# EAGLE design wemos_13a_moist (EAGLE 9.5.1)
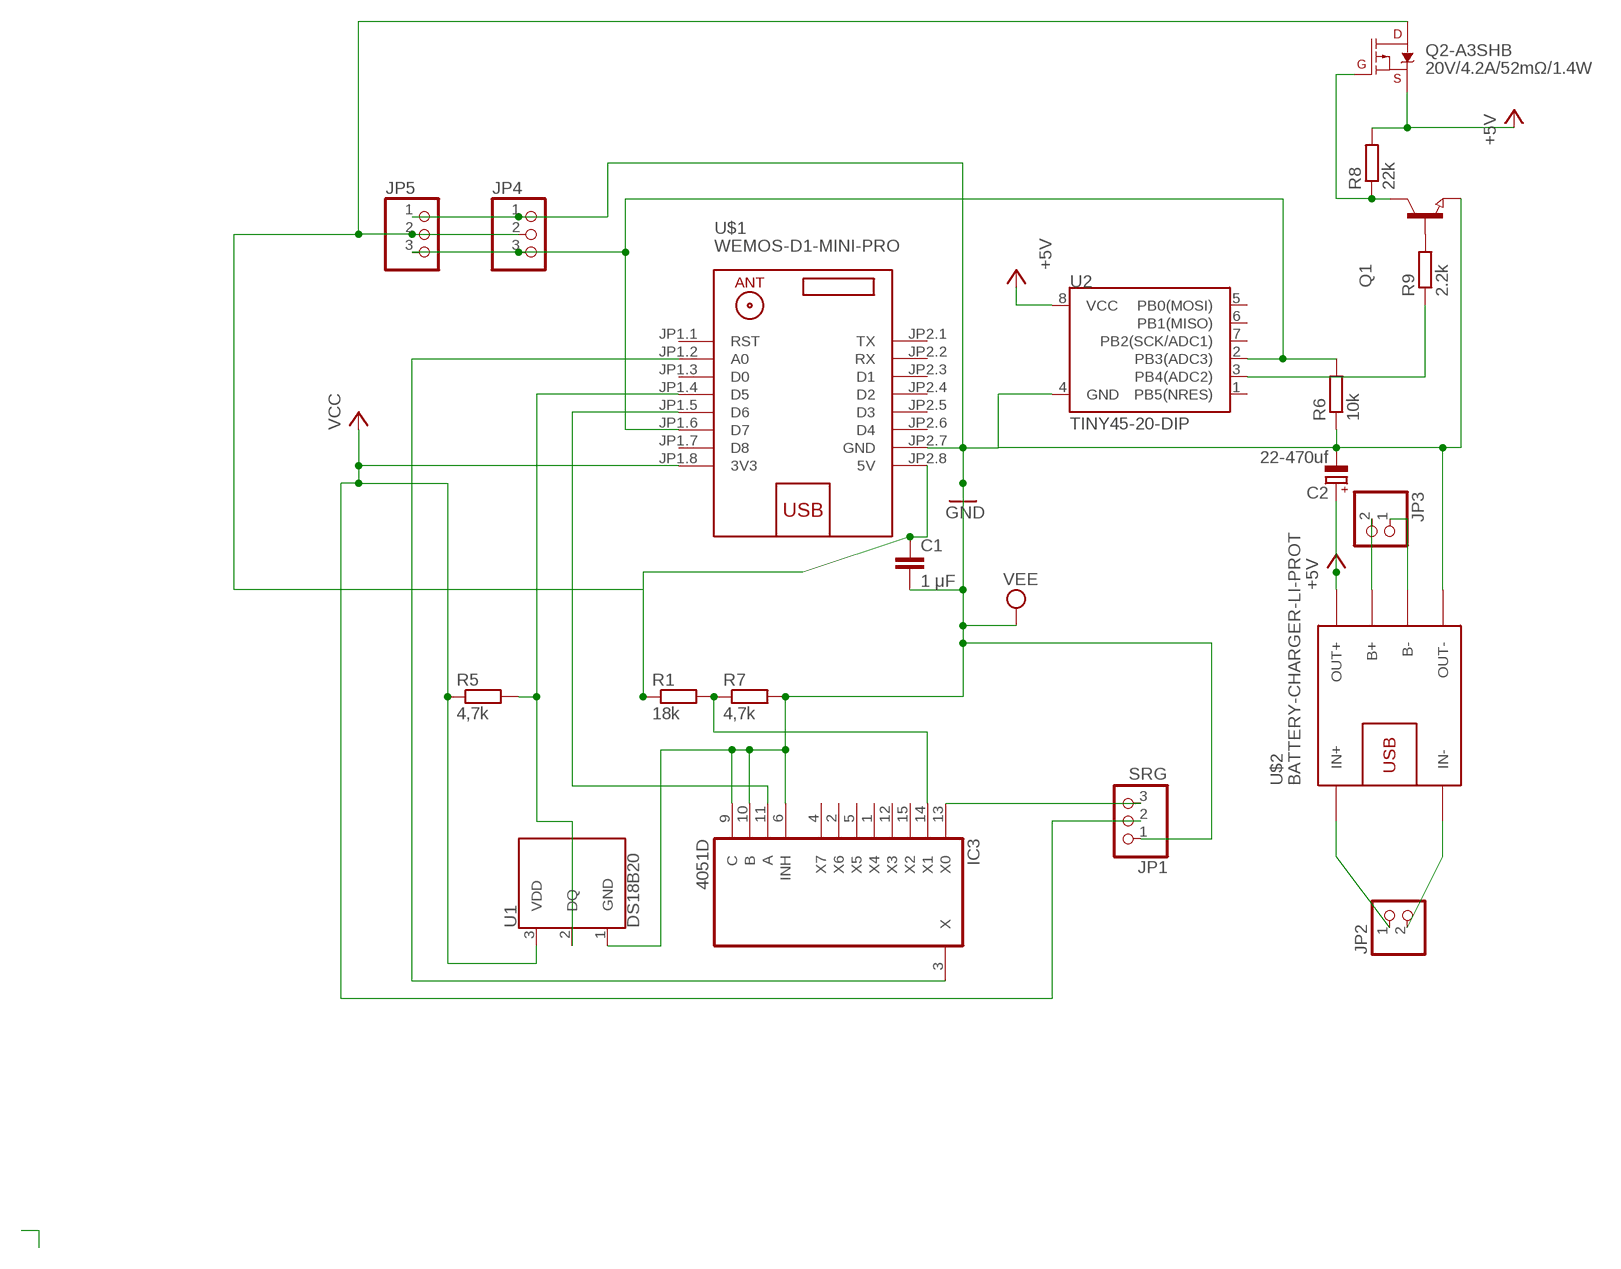
[diagram p0: schematic, sheet 1]

## Parts
C1  1 μF  C-EU025-024X044  [C025-024X044]
C2  22-470uf  CPOL-EUE2.5-5  [E2,5-5]
IC3  4051D  [SO16]
JP1  SRG  PINHD-1X3/90  [1X03/90]
JP2  PINHD-1X2  [1X02]
JP3  PINHD-1X2  [1X02]
JP4  PINHD-1X3  [1X03]
JP5  PINHD-1X3  [1X03]
Q1  NPN-TRANSISTOR_SOT23  [SOT23]
Q2-A3SHB  20V/4.2A/52mΩ/1.4W  MOSFET_PCH-DMG2305UX-7  [SOT23-3]
R1  18k  R-EU_0204/7  [0204/7]
R5  4,7k  R-EU_M1206  [M1206]
R6  10k  R-EU_M1206  [M1206]
R7  4,7k  R-EU_M1206  [M1206]
R8  22k  R-EU_M1206  [M1206]
R9  2.2k  R-EU_M1206  [M1206]
U1  DS18B20  [TO-92-AMMO]
U2  TINY45-20-DIP  ATTINY45TINY45-20-DIP  [DIP08_MCU]
U$1  WEMOS-D1-MINI-PRO  [WEMOS-D1-MINI-PRO]
U$2  BATTERY-CHARGER-LI-PROT  [BATTERY-CHARGER-LI-PROT]

## Nets
+5V: C2.+ Q1.3(C) Q2-A3SHB.1(G) Q2-A3SHB.2(S) R8.1 R8.2 U2.8(VCC) U$2.OUT+
GND: C1.2 C2.- IC3.6(INH) IC3.9(C) IC3.10(B) JP1.1 JP4.1 JP5.1 Q1.2(E) R6.1 R7.2 U1.1(GND) U2.4(GND) U$1.JP2.7(GND) U$2.OUT- ; supply symbol labelled VEE
N$1: JP3.2 U$2.B+
N$2: IC3.14(X1) R1.2 R7.1
N$3: IC3.11(A) U$1.JP1.5(D6)
N$4: IC3.3(X) U$1.JP1.2(A0)
N$5: JP3.1 U$2.B-
N$6: JP2.1 U$2.IN+
N$7: IC3.13(X0) JP1.3
N$8: R9.1 U2.3(PB4(ADC2))
N$9: JP4.3 JP5.3 R6.2 U2.2(PB3(ADC3)) U$1.JP1.6(D7)
N$12: Q1.1(B) R9.2
N$13: JP2.2 U$2.IN-
N$18: C1.1 JP4.2 JP5.2 Q2-A3SHB.3(D) R1.1 U$1.JP2.8(5V)
TEMP: R5.2 U1.2(DQ) U$1.JP1.4(D5)
VCC: JP1.2 R5.1 U1.3(VDD) U$1.JP1.8(3V3)
Unconnected: IC3.1(X4) IC3.2(X6) IC3.4(X7) IC3.5(X5) IC3.12(X3) IC3.15(X2) U2.1(PB5(NRES)) U2.5(PB0(MOSI)) U2.6(PB1(MISO)) U2.7(PB2(SCK/ADC1)) U$1.JP1.1(RST) U$1.JP1.3(D0) U$1.JP1.7(D8) U$1.JP2.1(TX) U$1.JP2.2(RX) U$1.JP2.3(D1) U$1.JP2.4(D2) U$1.JP2.5(D3) U$1.JP2.6(D4)

## Power pins joined to a net without a drawn wire
GND: IC3.7(VEE) IC3.8(GND)
VCC: IC3.16(VCC)

## Library data of the parts
C1 = rcl:C-EU: CAPACITOR, European symbol; SPICEPREFIX: C
C2 = rcl:CPOL-EU: POLARIZED CAPACITOR, European symbol; SPICEPREFIX: C
IC3 = 40xx:4051: 8-channel ANALOG MULTIPLEXER
JP1 JP4 JP5 = pinhead:PINHD-1X3: PIN HEADER
JP2 JP3 = pinhead:PINHD-1X2: PIN HEADER
Q1 = semicon-smd-ipc:NPN-TRANSISTOR_: NPN TRANSISTOR
Q2-A3SHB = SparkFun-DiscreteSemi:MOSFET_PCH: P-channel MOSFETs Voltage controlled devices that allow control of high current outputs. SparkFun Products: SparkFun ESP32 Thing <https://www.sparkfun.com/products/13907> SparkFun ESP8266 Thing <https://www.sparkfun.com/products/13231> SparkFun Pi Servo HAT V2 <https://www.sparkfun.com/products/15316> DMG2305UX-7 (20V/4.2A/SOT23-3); PROD_ID: TRAN-14388
R1 R5-R9 = rcl:R-EU_: RESISTOR, European symbol; SPICEPREFIX: R
U1 = SparkFun-Sensors:DS18B20: Dallas/Maxim DS18B20 1-Wire Temperature Sensor The DS18B20 reports degrees C with 9 to 12-bit precision, -55C to 125C (+/-0.5C). Each sensor has a unique 64-Bit Serial number etched into it - allows for a huge number of sensors to be used on one data bus. Datasheet <http://datasheets.maximintegrated.com/en/ds/DS18B20.pdf> SparkFun Products One Wire Digital Temperature Sensor - DS18B20 <https://www.sparkfun.com/products/245> (SEN-00245); STORE_ID: SEN-00245
U2 = SparkFun-Retired:ATTINY45: Atmel 8-pin 2/4/8kB flash uC Retired; PROD_ID: IC-09439
U$1 = diy-modules:WEMOS-D1-MINI-PRO: WEMOS D1 mini Pro: Mini Wi-Fi Board based on ESP-8266EX chip More details can be found here: https://www.wemos.cc/product/d1-mini-pro.html Click here to find device on ebay.com <http://www.ebay.com/sch/wemos+d1+mini+pro>
U$2 = diy-modules:BATTERY-CHARGER-LI-PROT: Lithium Battery 5V Charger with protection circuit More details available here: http://www.instructables.com/id/DIY-Lithium-ion-Battery-Charger/step4/TP4056-based-lithium-ion-battery-charger-module/ Click here to find device on ebay.com <http://www.ebay.com/sch/tp4056+charger+usb+protection>

## Board
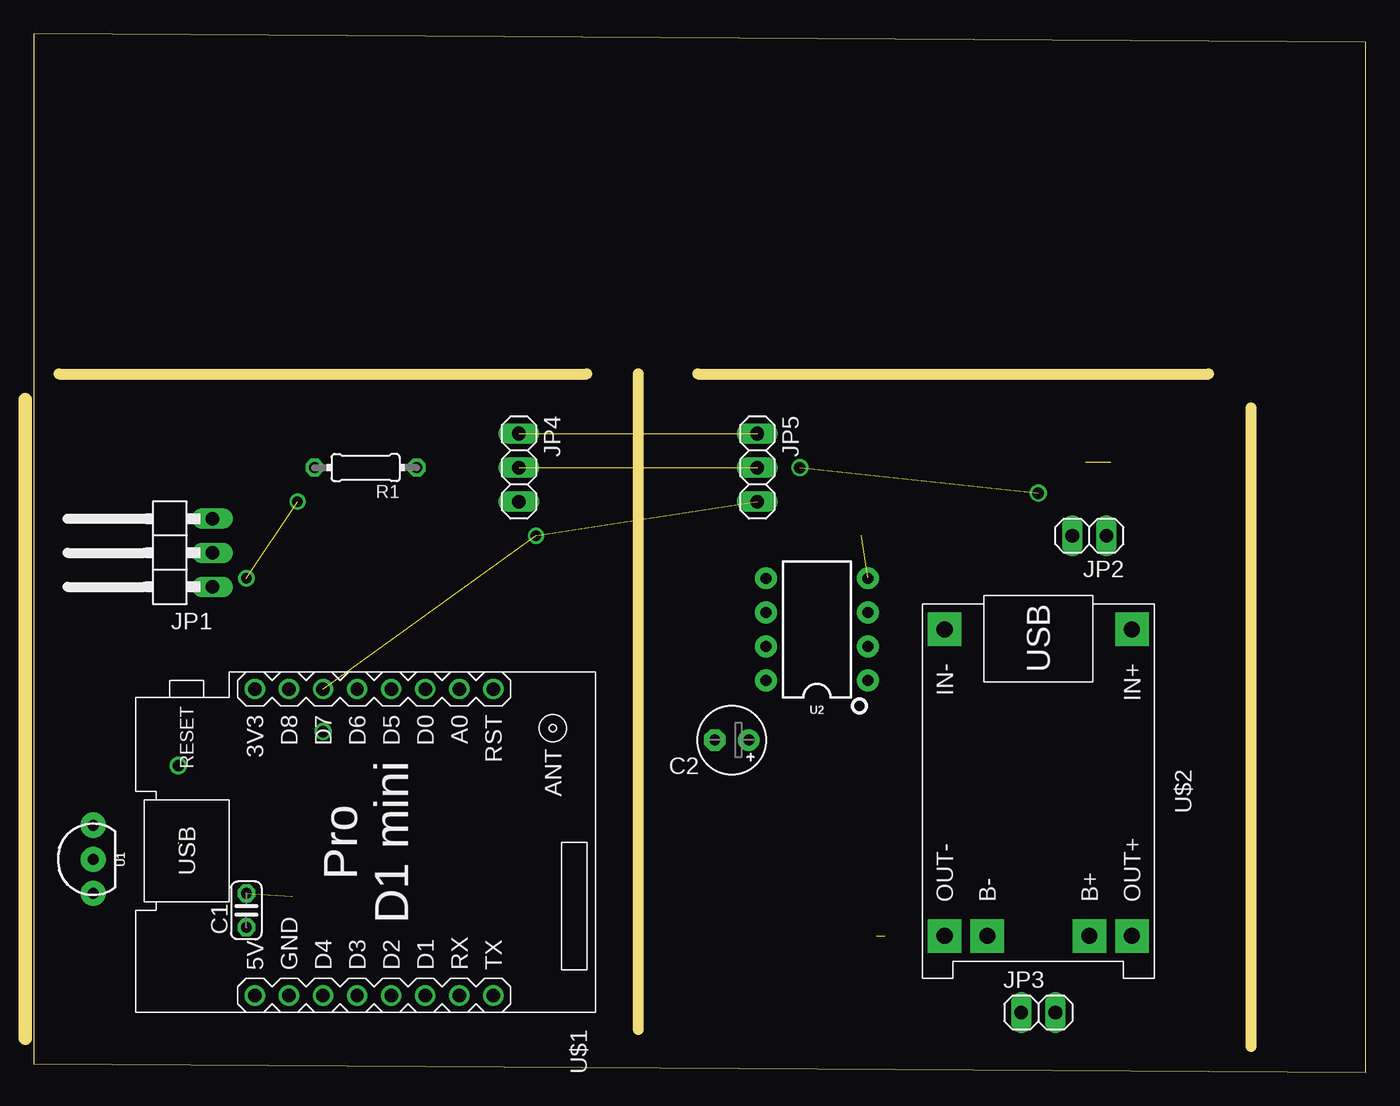
[diagram p1: board, top side]
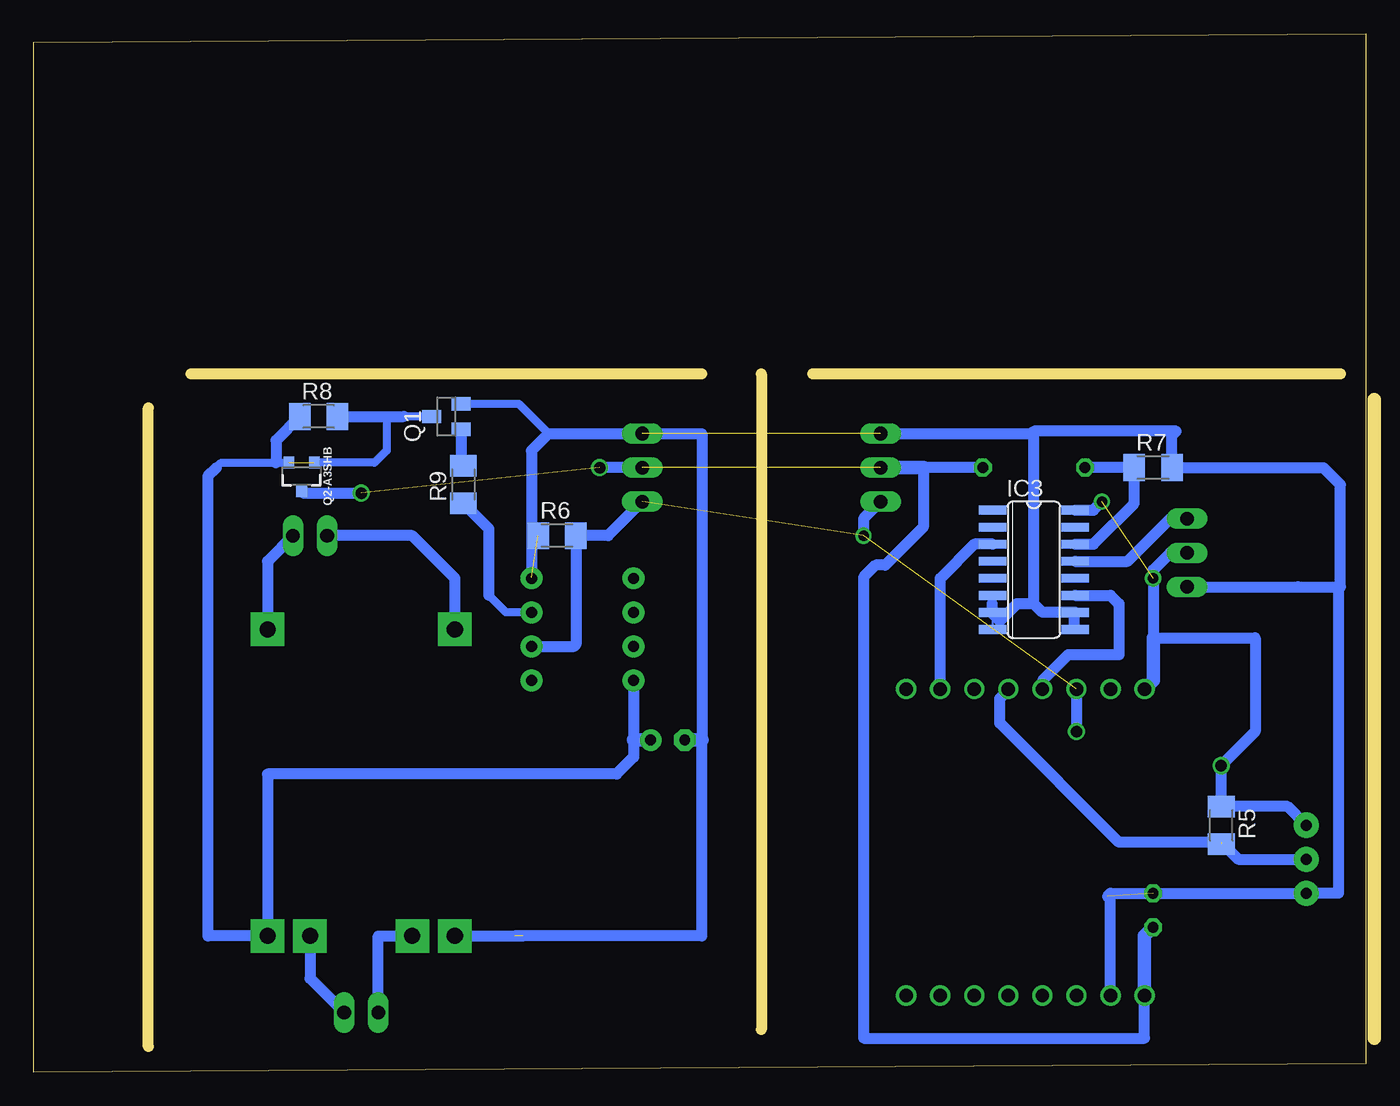
[diagram p2: board, bottom side, seen from below]

Size 99.36 x 77.46 mm. Coordinates in mm from the lower left corner, seen from the top.
Outline: 0,0.64 99.36,0 99.36,76.83 0,77.46 0,0.64
Copper layers (1*16): Top 0.035mm / dielectric 1.5mm / Bottom 0.035mm
Design rules "default": minimum track width 6mil, minimum drill 0.35mm, track to track 6mil, track to pad 6mil, pad to pad 6mil, via to via 6mil, smd to smd 6mil, copper to edge 40mil, drill to drill 6mil, minimum pad ring 10mil, minimum via ring 8mil, stop-mask expansion 4mil, vias tented up to drill 0mil, thermal gap 10mil
Milling: 5 lines

### Footprints (pad centres in the part's own frame; a part is rotated, then mirrored left to right if it is on the bottom)
C025-024X044 = drill 0.813 octagon: 1 -1.27,0; 2 1.27,0
E2,5-5 = drill 0.813 pad 1.6: + -1.27,0 | drill 0.813 pad 1.6 octagon: - 1.27,0
SO16 = smd 0.66 x 2.032: 1 -4.445,-3.073; 2 -3.175,-3.073; 3 -1.905,-3.073; 4 -0.635,-3.073; 5 0.635,-3.073; 6 1.905,-3.073; 7 3.175,-3.073; 8 4.445,-3.073; 9 4.445,3.073; 10 3.175,3.073; 11 1.905,3.073; 12 0.635,3.073; 13 -0.635,3.073; 14 -1.905,3.073; 15 -3.175,3.073; 16 -4.445,3.073
1X03/90 = drill 1.016 long: 1 -2.54,-3.81; 2 0,-3.81; 3 2.54,-3.81
1X02 = drill 1.016 long: 1 -1.27,0; 2 1.27,0
1X03 = drill 1.016 long: 1 -2.54,0; 2 0,0; 3 2.54,0
SOT23 = smd 1 x 1.4: 1 -0.95,-1.1; 2 0.95,-1.1; 3 0,1.1
SOT23-3 = smd 0.8 x 0.9: 1 -0.95,-1; 2 0.95,-1; 3 0,1.1
0204/7 = drill 0.813 octagon: 1 -3.81,0; 2 3.81,0
M1206 = smd 1.6 x 2: 1 -1.4,0; 2 1.4,0
TO-92-AMMO = drill 0.813 pad 1.88: 1 -2.54,0; 2 0,0; 3 2.54,0
DIP08_MCU = drill 0.813 pad 1.626: 1 -3.81,-3.81; 2 -1.27,-3.81; 3 1.27,-3.81; 4 3.81,-3.81; 5 3.81,3.81; 6 1.27,3.81; 7 -1.27,3.81; 8 -3.81,3.81
WEMOS-D1-MINI-PRO = drill 1: JP1.1 -11.43,9.525; JP1.2 -11.43,6.985; JP1.3 -11.43,4.445; JP1.4 -11.43,1.905; JP1.5 -11.43,-0.635; JP1.6 -11.43,-3.175; JP1.7 -11.43,-5.715; JP1.8 -11.43,-8.255; JP2.1 11.43,9.525; JP2.2 11.43,6.985; JP2.3 11.43,4.445; JP2.4 11.43,1.905; JP2.5 11.43,-0.635; JP2.6 11.43,-3.175; JP2.7 11.43,-5.715; JP2.8 11.43,-8.255
BATTERY-CHARGER-LI-PROT = drill 1.2 pad 2.5 square: B+ 10.795,3.81; B- 10.795,-3.81; IN+ -12.065,6.985; IN- -12.065,-6.985; OUT+ 10.795,6.985; OUT- 10.795,-6.985

### Placement (x,y rotation side)
C1  15.88,12.07 90 top
C2  52.07,24.77 180 top
IC3  24.76,37.47 270 bottom
JP1  9.53,38.73 90 top
JP2  78.74,40.01 180 top
JP3  74.93,4.45 0 top
JP4  36.2,45.09 270 top
JP5  53.98,45.09 270 top
Q1  68.58,48.9 90 bottom
Q2-A3SHB  79.38,44.45 180 bottom
R1  24.76,45.09 180 top
R5  10.79,18.41 270 bottom
R6  60.33,40.01 0 bottom
R7  15.88,45.09 0 bottom
R8  78.1,48.9 0 bottom
R9  67.31,43.82 90 bottom
U1  4.45,15.88 90 top
U2  58.42,33.02 90 top
U$1  24.76,17.14 270 top
U$2  74.93,20.95 270 top

### Tracks (layer width: path | path; a pad name or v marks a point on that pad's centre or on a via)
+5V  (1 unrouted)
  Bottom 0.61: 85.72,45.09 85.36,45.45 81.28,45.45 Q2-A3SHB.2 | Q1.3 71.75,48.9 73.02,48.9 73.02,46.36 73.93,45.45 Q2-A3SHB.1
  Bottom 0.813: 85.72,45.09 86.36,44.45 86.36,10.16 U$2.OUT+ 81.91,22.22 55.88,22.22 54.61,23.5 54.61,24.77 U2.8 | R8.2 71.75,48.9 | R8.1 81.28,47.12 81.28,45.45
  Bottom 1.016: 54.61,24.77 C2.+
GND  (4 unrouted)
  Bottom 0.152: 21.77,33.1 IC3.9 | 21.16,34.32 21.61,34.32 IC3.10 | 28.47,35.69 27.86,35.69 IC3.6 27.86,35.54 27.86,34.93 27.86,34.32 IC3.7 27.86,34.16 27.86,33.1 IC3.8 27.86,32.94 28.78,32.94 | 13.34,36.3 JP1.1 | 19.18,5.82 U$1.JP2.7 | 62.23,36.88 U2.4
  Bottom 0.61: Q1.2 63.18,49.85 60.96,47.62
  Bottom 0.813: U$1.JP2.7 19.05,13.34 | 19.05,13.34 U1.1 2.06,13.34 2.06,36.2 | 24.76,34.93 24.76,47.8 | 24.76,34.93 24.13,34.29 IC3.10 21.77,34.21 21.77,33.1 | 24.76,34.93 26.04,34.93 27.3,33.66 27.86,34.21 27.86,34.93 | 24.76,47.8 14.15,47.8 14.47,47.48 R7.2 3.17,45.09 1.91,43.82 1.91,36.2 2.06,36.2 | JP1.1 5.08,36.2 2.06,36.2 | 63.5,10.16 49.53,10.16 49.53,24.77 49.53,47.62 JP5.1 60.96,47.62 62.23,46.36 U2.4 | JP4.1 24.94,47.62 24.76,47.8 | 19.28,13.11 19.05,13.34 | U$2.OUT- 62.87,10.16
  Bottom 1.016: 49.53,24.77 C2.-
N$1
  Bottom 0.813: U$2.B+ 78.74,6.99 JP3.2
N$2
  Bottom 0.152: 21.16,39.5 21.61,39.5 IC3.14
  Bottom 0.813: IC3.14 20.32,39.37 17.27,42.42 R7.1 R1.2
N$3
  Bottom 0.152: 22.22,35.54 21.77,35.54 IC3.11 | 24.05,28.68 U$1.JP1.5
  Bottom 0.813: IC3.11 19.05,35.56 18.41,34.93 18.41,31.11 22.22,31.11 24.13,29.21 U$1.JP1.5
N$4
  Bottom 0.152: 27.41,39.35 27.71,39.35 IC3.3 | 31.67,28.68 U$1.JP1.2
  Bottom 0.813: U$1.JP1.2 31.75,36.83 29.21,39.37 IC3.3
N$5
  Bottom 0.813: JP3.1 73.66,10.16 U$2.B-
N$6
  Bottom 0.813: JP2.1 81.91,38.1 U$2.IN+
N$7
  Bottom 0.152: 21.61,38.12 IC3.13
  Bottom 0.813: IC3.13 17.78,38.1 14.61,41.28 JP1.3
N$8
  Bottom 0.61: U2.3 64.13,34.29 65.41,35.56
  Bottom 0.813: R9.1 65.41,40.51 65.41,35.56
N$9  (via drill 0.8)  (2 unrouted)
  Bottom 0.813: 21.59,28.09 U$1.JP1.6 21.59,25.4 | JP4.3 37.47,41.28 v37.47,40.01 | U2.2 59.05,31.75 58.93,31.88 R6.2 56.52,40.01 JP5.3
N$10  (via drill 0.85 pad 0.9)
  other vias: 21.59,25.4
N$12
  Bottom 0.813: Q1.1 67.48,45.39 R9.2
N$13
  Bottom 0.813: U$2.IN- 67.94,36.83 71.12,40.01 JP2.2
N$14  (via drill 0.85)
  other vias: 57.15,45.09
N$16  (via drill 0.85)
  other vias: 74.93,43.18
N$18  (2 unrouted)
  Bottom 0.813: U$1.JP2.8 16.51,2.54 37.47,2.54 37.47,36.92 36.57,37.82 35.84,37.82 33.02,40.64 33.02,45.09 R1.1 | 55.25,45.09 JP5.2 57.15,45.09 | Q2-A3SHB.3 79.2,43.18 74.93,43.18
  Bottom 1.016: C1.1 16.51,10.16 U$1.JP2.8 | 33.02,45.09 JP4.2
TEMP  (1 unrouted)
  Bottom 0.152: 26.64,28.52 U$1.JP1.4
  Bottom 0.813: 10.79,17.14 9.53,15.88 U1.2 | 26.64,28.52 27.3,27.86 27.3,26.04 18.41,17.14 10.93,17.14 R5.2
VCC  (via drill 0.8, 0.85 pad 0.9)  (1 unrouted)
  Bottom 0.813: JP1.2 14.61,38.73 15.88,37.47 v15.88,36.83 15.88,32.39 8.26,32.39 8.26,25.4 v10.79,22.86 R5.1 5.85,19.81 U1.3 | IC3.16 20.32,41.91 v19.68,42.55
  Bottom 1.016: U$1.JP1.8 15.88,29.21 15.88,32.39